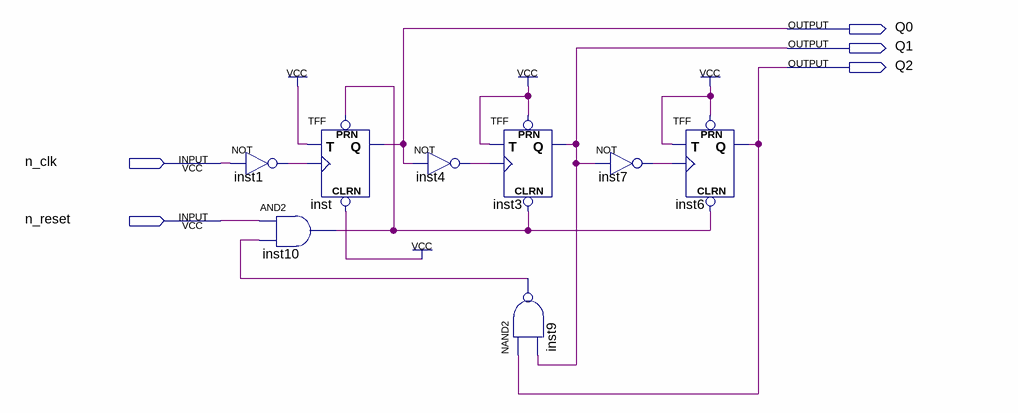
[diagram p0: schematic sheet]
// Quartus schematic 3bit_ripple.bdf as structural Verilog: 8 symbols, 5 pins
module \3bit_ripple  (
  input  n_clk,
  input  n_reset,
  output Q0,
  output Q1,
  output Q2
);

  wire inst1_out, inst4_out, inst7_out, inst9_out, inst10_out;

  not inst1 (inst1_out, n_clk);
  and inst10 (inst10_out, n_reset, inst9_out);
  TFF inst (.PRN(inst10_out), .CLRN(1'b1), .T(1'b1), .CLK(inst1_out), .Q(Q0));
  not inst4 (inst4_out, Q0);
  TFF inst3 (.PRN(1'b1), .CLRN(inst10_out), .T(1'b1), .CLK(inst4_out), .Q(Q1));
  nand inst9 (inst9_out, Q2, Q1);
  not inst7 (inst7_out, Q1);
  TFF inst6 (.PRN(1'b1), .CLRN(inst10_out), .T(1'b1), .CLK(inst7_out), .Q(Q2));
endmodule
